# EAGLE design year-shift-r1 (EAGLE 6.5.0)
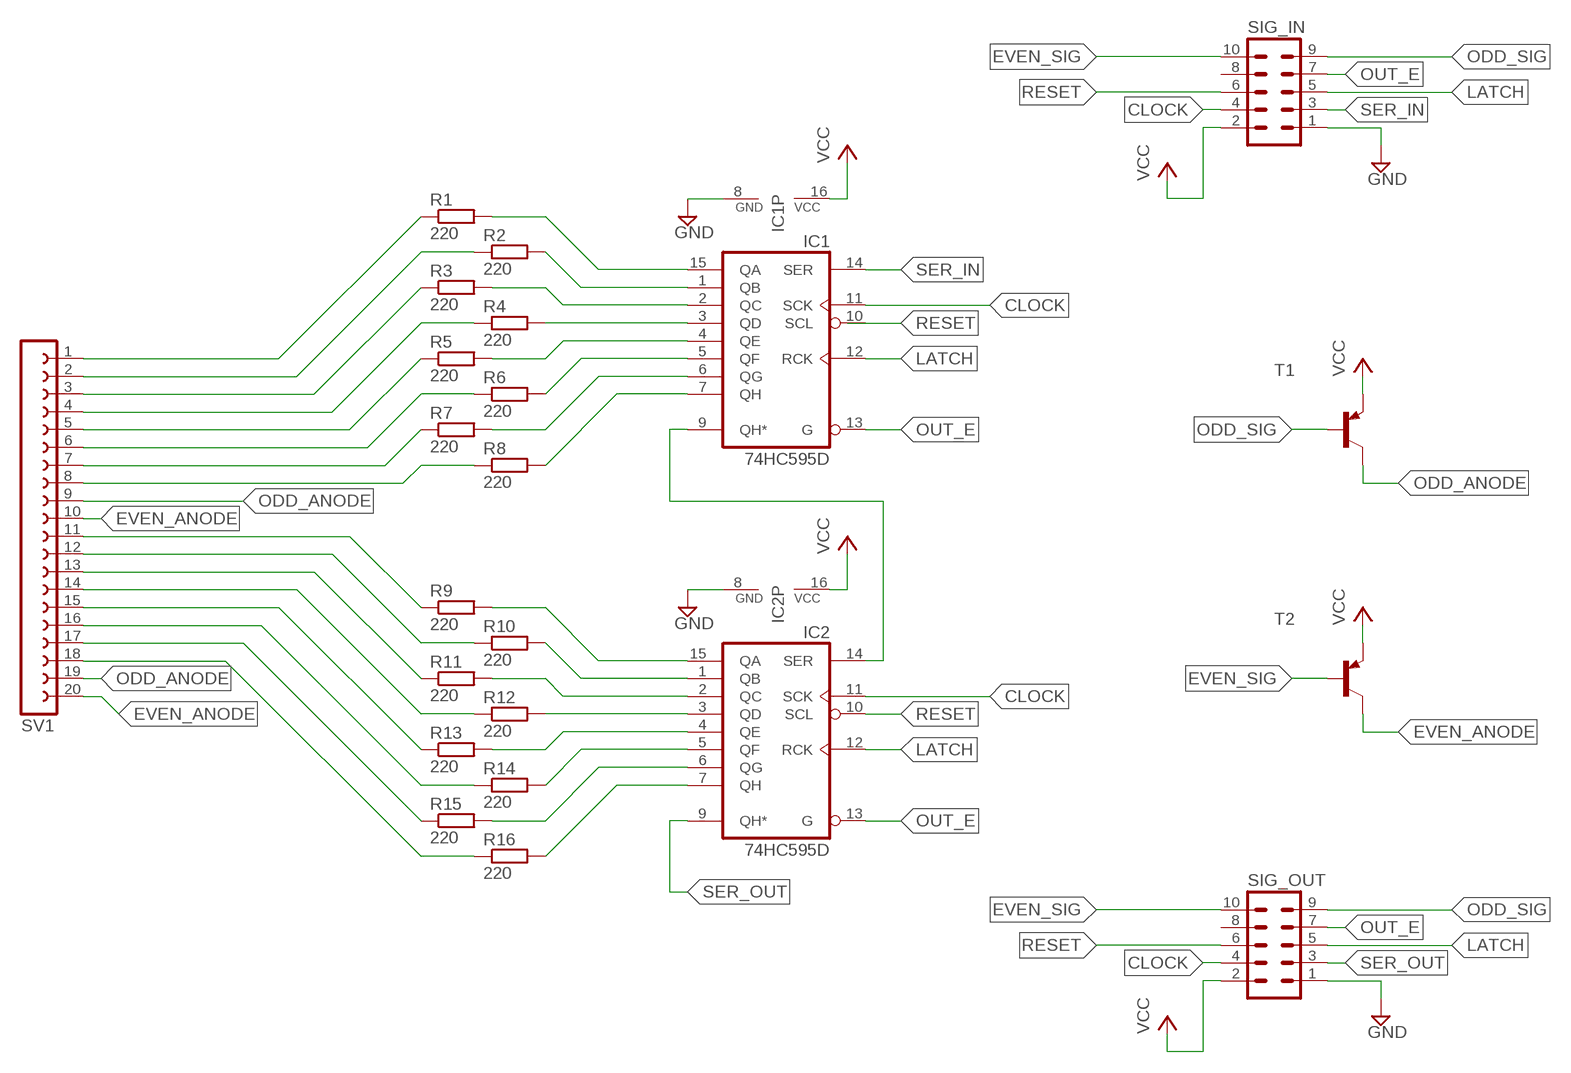
[diagram p0: schematic, sheet 1]

## Parts
IC1  74HC595D  [SO16]
IC2  74HC595D  [SO16]
R1  220  R-EU_R0805  [R0805]
R2  220  R-EU_R0805  [R0805]
R3  220  R-EU_R0805  [R0805]
R4  220  R-EU_R0805  [R0805]
R5  220  R-EU_R0805  [R0805]
R6  220  R-EU_R0805  [R0805]
R7  220  R-EU_R0805  [R0805]
R8  220  R-EU_R0805  [R0805]
R9  220  R-EU_R0805  [R0805]
R10  220  R-EU_R0805  [R0805]
R11  220  R-EU_R0805  [R0805]
R12  220  R-EU_R0805  [R0805]
R13  220  R-EU_R0805  [R0805]
R14  220  R-EU_R0805  [R0805]
R15  220  R-EU_R0805  [R0805]
R16  220  R-EU_R0805  [R0805]
SIG_IN  MA05-2  [MA05-2]
SIG_OUT  MA05-2  [MA05-2]
SV1  FE20-1  [FE20]
T1  BC557B-PNP-TO92-EBC  [TO92-EBC]
T2  BC557B-PNP-TO92-EBC  [TO92-EBC]

## Nets
CLOCK: IC1.11(SCK) IC2.11(SCK) SIG_IN.4 SIG_OUT.4
EVEN_ANODE: SV1.10 SV1.20 T2.C
EVEN_SIG: SIG_IN.10 SIG_OUT.10 T2.B
GND: IC1.8(GND) IC2.8(GND) SIG_IN.1 SIG_OUT.1
LATCH: IC1.12(RCK) IC2.12(RCK) SIG_IN.5 SIG_OUT.5
N$1: IC1.15(QA) R1.2
N$2: IC1.2(QC) R3.2
N$3: IC1.4(QE) R5.2
N$4: IC1.6(QG) R7.2
N$5: R8.1 SV1.8
N$6: R6.1 SV1.6
N$7: R4.1 SV1.4
N$8: R2.1 SV1.2
N$9: IC1.1(QB) R2.2
N$10: IC1.3(QD) R4.2
N$11: IC1.5(QF) R6.2
N$12: IC1.7(QH) R8.2
N$13: IC2.15(QA) R9.2
N$14: IC2.2(QC) R11.2
N$15: IC2.4(QE) R13.2
N$16: IC2.6(QG) R15.2
N$17: R16.1 SV1.18
N$18: R14.1 SV1.16
N$19: R12.1 SV1.14
N$20: R10.1 SV1.12
N$21: IC2.1(QB) R10.2
N$22: IC2.3(QD) R12.2
N$23: IC2.5(QF) R14.2
N$24: IC2.7(QH) R16.2
N$25: IC1.9(QH*) IC2.14(SER)
N$26: R1.1 SV1.1
N$27: R3.1 SV1.3
N$28: R5.1 SV1.5
N$29: R7.1 SV1.7
N$30: R9.1 SV1.11
N$31: R11.1 SV1.13
N$32: R13.1 SV1.15
N$33: R15.1 SV1.17
ODD_ANODE: SV1.9 SV1.19 T1.C
ODD_SIG: SIG_IN.9 SIG_OUT.9 T1.B
OUT_E: IC1.13(G) IC2.13(G) SIG_IN.7 SIG_OUT.7
RESET: IC2.10(SCL) SIG_IN.6 SIG_OUT.6
SER_IN: IC1.14(SER) SIG_IN.3
SER_OUT: IC2.9(QH*) SIG_OUT.3
VCC: IC1.16(VCC) IC2.16(VCC) SIG_IN.2 SIG_OUT.2 T1.E T2.E
Unconnected: IC1.10(SCL) SIG_IN.8 SIG_OUT.8

## Library data of the parts
IC1 IC2 = 74xx-eu:74*595: 8-bit SHIFT REGISTER, output latch
R1-R16 = rcl:R-EU_: RESISTOR, European symbol
SIG_IN SIG_OUT = con-lstb:MA05-2: PIN HEADER; OC_FARNELL: unknown; OC_NEWARK: unknown
SV1 = con-lsta:FE20-1: FEMALE HEADER; OC_FARNELL: unknown; OC_NEWARK: unknown
T1 T2 = transistor:*-PNP-: PNP Transistror

## Board
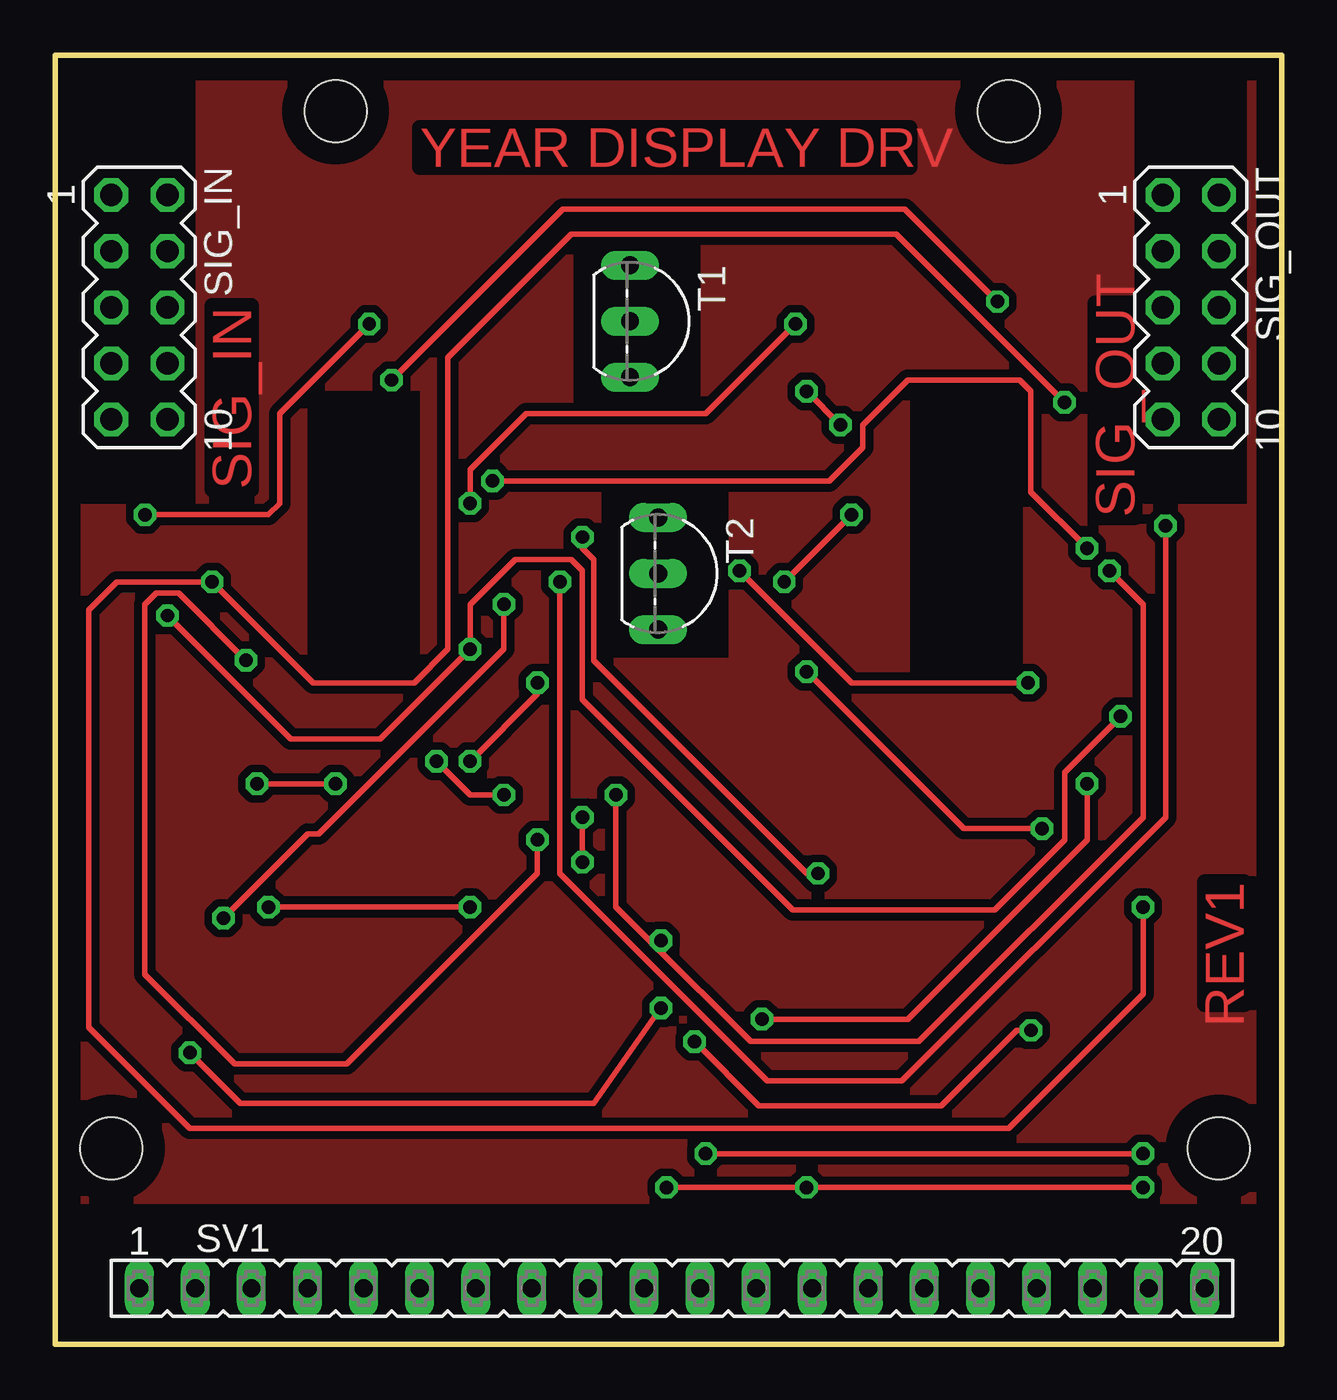
[diagram p1: board, top side]
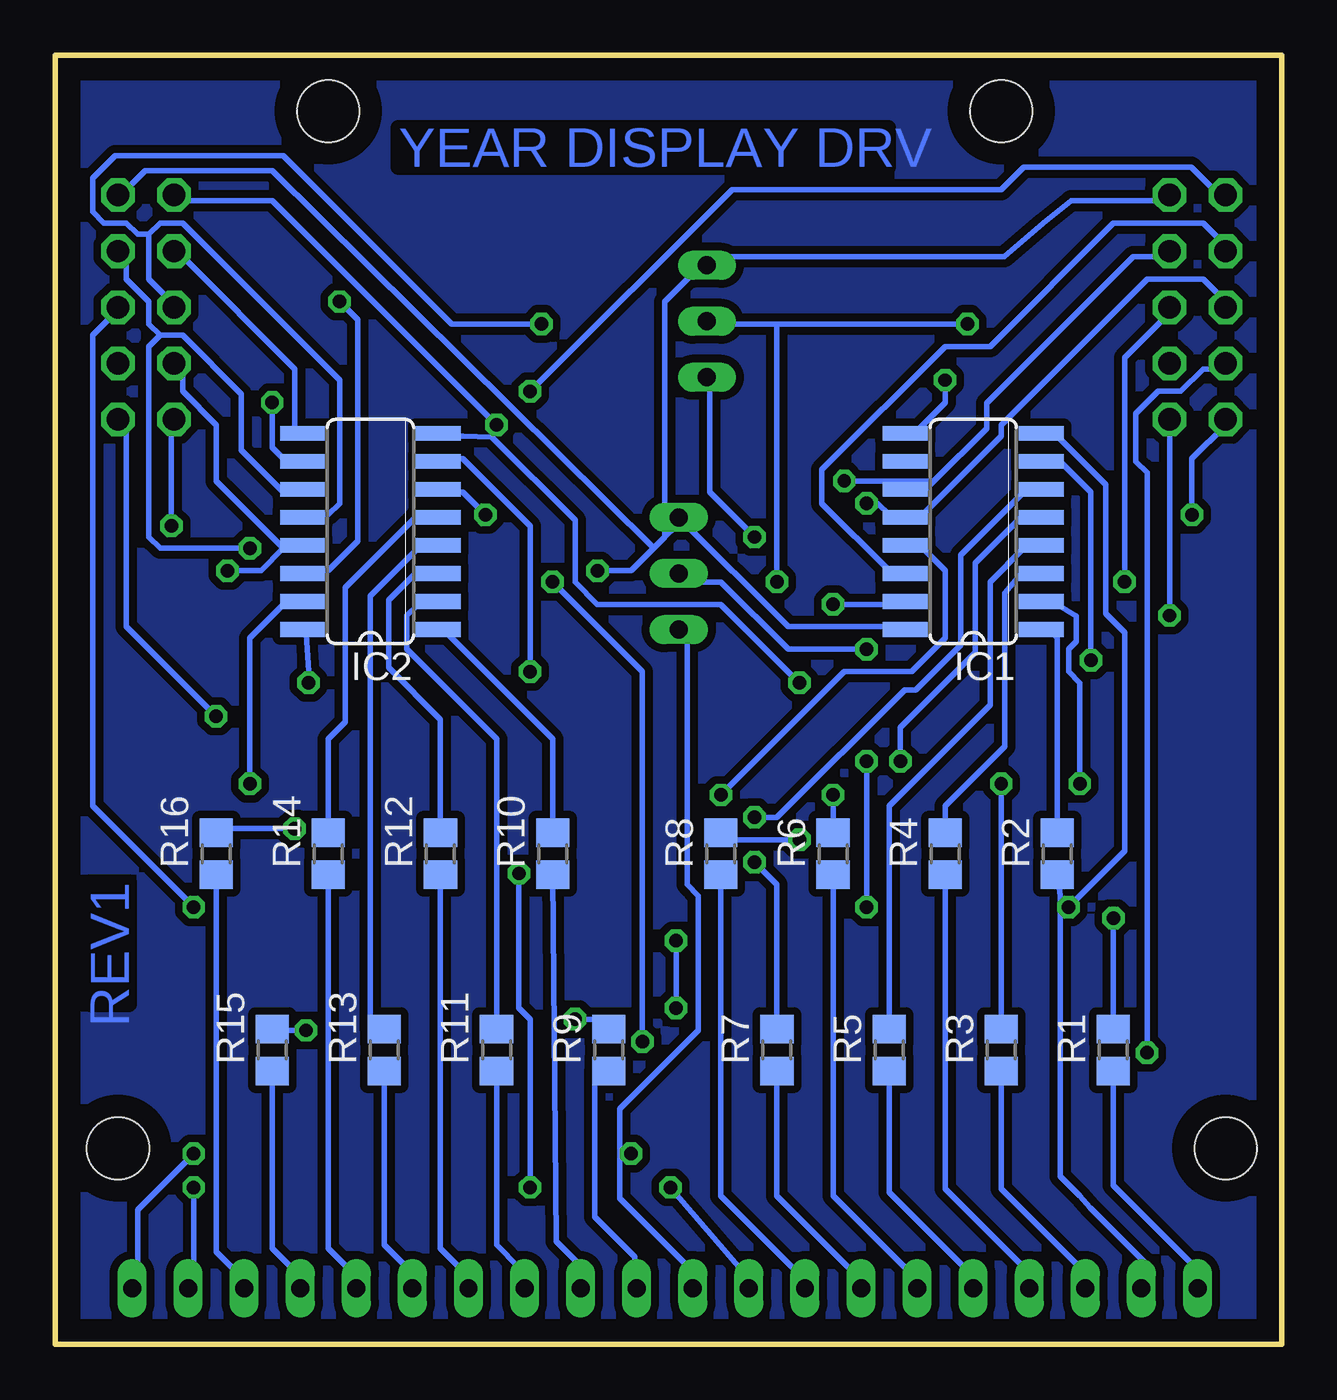
[diagram p2: board, bottom side, seen from below]

Size 55.55 x 58.41 mm. Coordinates in mm from the lower left corner, seen from the top.
Outline: 0,0 55.55,0 55.55,58.41 0,58.41 0,0
Copper layers (1*16): Top 0.035mm / dielectric 1.5mm / Bottom 0.035mm
Design rules "default *": minimum track width 10mil, minimum drill 24mil, track to track 14mil, track to pad 14mil, pad to pad 14mil, via to via 14mil, smd to smd 14mil, copper to edge 40mil, drill to drill 8mil, minimum pad ring 10mil, minimum via ring 8mil, stop-mask expansion 4mil, vias tented up to drill 0mil, thermal gap 10mil
Holes 2.8 mm at 12.7,55.88 43.18,55.88 2.54,8.89 52.7,8.89
tRestrict: area 1.3,1.3 to 54.6,6.3; area 1.3,38.1 to 6.3,58.4; area 48.9,38.1 to 54,58.4; area 11.4,30.5 to 16.5,43.2; area 38.7,30.5 to 43.8,43.2; area 23.5,42.5 to 29.2,50.2; area 24.8,31.1 to 30.5,38.7

### Footprints (pad centres in the part's own frame; a part is rotated, then mirrored left to right if it is on the bottom)
SO16 = smd 0.66 x 2.032: 1 -4.445,-3.073; 2 -3.175,-3.073; 3 -1.905,-3.073; 4 -0.635,-3.073; 5 0.635,-3.073; 6 1.905,-3.073; 7 3.175,-3.073; 8 4.445,-3.073; 9 4.445,3.073; 10 3.175,3.073; 11 1.905,3.073; 12 0.635,3.073; 13 -0.635,3.073; 14 -1.905,3.073; 15 -3.175,3.073; 16 -4.445,3.073
R0805 = smd 1.3 x 1.5: 1 -0.95,0; 2 0.95,0
MA05-2 = drill 1.016 octagon: 1 -5.08,-1.27; 2 -5.08,1.27; 3 -2.54,-1.27; 4 -2.54,1.27; 5 0,-1.27; 6 0,1.27; 7 2.54,-1.27; 8 2.54,1.27; 9 5.08,-1.27; 10 5.08,1.27
FE20 = drill 0.813 long: 1 -24.13,0; 2 -21.59,0; 3 -19.05,0; 4 -16.51,0; 5 -13.97,0; 6 -11.43,0; 7 -8.89,0; 8 -6.35,0; 9 -3.81,0; 10 -1.27,0; 11 1.27,0; 12 3.81,0; 13 6.35,0; 14 8.89,0; 15 11.43,0; 16 13.97,0; 17 16.51,0; 18 19.05,0; 19 21.59,0; 20 24.13,0
TO92-EBC = drill 0.813 long: B 0,-1.27; C 2.54,-1.27; E -2.54,-1.27

### Placement (x,y rotation side)
IC1  13.97,36.83 90 bottom
IC2  41.27,36.83 90 bottom
R1  7.62,13.34 90 bottom
R2  10.16,22.23 90 bottom
R3  12.7,13.34 90 bottom
R4  15.24,22.23 90 bottom
R5  17.78,13.34 90 bottom
R6  20.32,22.23 90 bottom
R7  22.86,13.34 90 bottom
R8  25.4,22.23 90 bottom
R9  30.48,13.34 90 bottom
R10  33.02,22.23 90 bottom
R11  35.56,13.34 90 bottom
R12  38.1,22.23 90 bottom
R13  40.64,13.34 90 bottom
R14  43.18,22.23 90 bottom
R15  45.72,13.34 90 bottom
R16  48.26,22.23 90 bottom
SIG_IN  3.81,46.99 270 top
SIG_OUT  51.44,46.99 270 top
SV1  27.94,2.54 0 top
T1  27.3,46.35 270 top
T2  28.57,34.92 270 top

### Tracks (layer width: path | path; a pad name or v marks a point on that pad's centre or on a via)
CLOCK  (via drill 0.61)
  Top 0.254: v46.74,36.07 44.2,38.61 44.2,43.18 43.69,43.69 38.61,43.69 36.58,41.66 36.58,40.64 35.05,39.12 v19.81,39.12
  Bottom 0.254: 50.8,45.72 49.78,45.72 47.12,43.05 47.12,40.51 45.21,38.61 44.7,38.61 IC2.11 | 50.8,45.72 51.31,46.23 51.31,47.24 52.32,48.26 52.32,49.28 SIG_OUT.4 | 15.75,39.12 13.37,41.5 13.37,42.64 6.73,49.28 5.08,49.28 SIG_IN.4 | 15.75,39.12 16.26,38.61 16.76,38.61 IC1.11 | 50.8,45.72 51.31,45.21 51.31,36.58 50.8,36.07 v46.74,36.07 | 15.75,39.12 v19.81,39.12
EVEN_ANODE  (via drill 0.61)
  Top 0.254: v29.46,8.64 v49.28,8.64
  Bottom 0.254: 29.97,8.64 29.97,10.67 26.42,14.22 26.42,20.32 26.92,20.83 26.92,32 T2.C | 29.97,8.64 29.97,6.6 26.92,3.56 26.92,2.54 SV1.10 | v49.28,8.64 51.82,6.1 51.82,2.54 SV1.20 | 29.97,8.64 v29.46,8.64
EVEN_SIG  (via drill 0.61)
  Top 0.254: v5.08,33.02 10.67,27.43 14.73,27.43 v18.8,31.5 18.8,33.53 20.83,35.56 23.37,35.56 23.88,35.05 23.88,29.21 33.4,19.68 42.55,19.68 45.72,22.86 45.72,25.91 v48.26,28.45
  Bottom 0.254: v18.8,31.5 22.35,31.5 25.4,34.54 26.92,34.54 T2.B | SIG_IN.10 v5.08,33.02 | v48.26,28.45 52.32,32.51 52.32,41.66 SIG_OUT.10
GND  (via drill 0.61)
  Top 0.254: v18.8,19.81 v9.65,19.81 | v18.8,26.42 21.84,29.46 v21.84,29.97 | v35.56,41.66 v34.04,43.18
  Bottom 0.254: 11.18,41.15 IC1.8 10.67,41.15 10.16,41.15 7.97,38.96 7.97,33.12 7.11,32.26 7.11,22.35 v9.65,19.81 | v18.8,26.42 v18.8,19.81 | v21.84,29.97 25.4,33.53 30.99,33.53 32,34.54 32,37.34 35.78,41.12 | 35.78,41.12 37.08,41.15 38.1,41.15 IC2.8 38.61,41.15 | v34.04,43.18 24.89,52.32 12.7,52.32 11.68,53.34 4.1,53.34 3.08,52.32 2.54,52.32 SIG_IN.1 | 35.78,41.12 v35.56,41.66 45.72,51.82 49.78,51.82 SIG_OUT.1
LATCH  (via drill 0.61)
  Top 0.254: v33.53,46.23 29.46,42.16 21.34,42.16 18.8,39.62 v18.8,38.1
  Bottom 0.254: 51.31,50.29 50.8,50.8 49.78,50.8 42.67,43.69 42.67,38.1 43.18,37.59 44.2,37.59 IC2.12 | 51.31,50.29 51.31,48.26 50.29,47.24 SIG_OUT.5 | SIG_IN.5 2.54,47.24 3.56,48.26 6.1,48.26 12.7,41.66 12.7,41.15 16.26,37.59 16.76,37.59 IC1.12 17.27,37.59 17.78,37.59 18.29,38.1 v18.8,38.1 | 51.31,50.29 51.82,50.29 52.32,50.8 53.34,50.8 53.85,51.31 53.85,52.83 52.83,53.85 45.21,53.85 37.59,46.23 v33.53,46.23
N$1  (via drill 0.61)
  Top 0.254: v7.62,19.3 11.43,23.11 11.94,23.11 20.32,31.5 v20.32,33.53
  Bottom 0.254: v7.62,19.3 R1.2 | v20.32,33.53 17.27,33.53 IC1.15
N$2  (via drill 0.61)
  Top 0.254: v9.14,25.4 v12.7,25.4
  Bottom 0.254: v12.7,25.4 R3.2 | v9.14,25.4 9.14,29.97 9.65,30.48 9.65,31.5 9.3,31.84 9.3,32.99 10.16,33.53 10.67,33.53 IC1.2
N$3
  Bottom 0.254: R5.2 17.78,24.38 13.21,28.96 13.21,34.54 11.68,36.07 11.18,36.07 IC1.4
N$4  (via drill 0.61)
  Top 0.254: v23.88,23.88 v23.88,21.84
  Bottom 0.254: R7.2 22.86,20.83 v23.88,21.84 | v23.88,23.88 22.86,23.88 17.08,29.65 16.57,29.65 14.54,31.69 14.54,35.75 11.68,38.61 11.18,38.61 IC1.6
N$5
  Bottom 0.254: R8.1 25.4,6.73 21.84,3.17 SV1.8
N$6
  Bottom 0.254: R6.1 20.32,6.73 16.76,3.17 SV1.6
N$7
  Bottom 0.254: R4.1 15.24,7.05 11.68,3.49 SV1.4
N$8
  Bottom 0.254: R2.1 10.16,21.46 10.03,20.32 10.03,7.62 9.14,6.73 8.67,6.19 6.13,3.65 SV1.2
N$9
  Bottom 0.254: R2.2 10.16,32 10.67,32.51 IC1.1
N$10
  Bottom 0.254: R4.2 15.24,24.38 12.54,27.08 12.54,34.04 11.68,35.05 11.18,35.05 IC1.3
N$11  (via drill 0.61)
  Top 0.254: v20.32,24.89 18.8,24.89 v17.27,26.42
  Bottom 0.254: v20.32,24.89 R6.2 | v17.27,26.42 17.27,27.94 13.88,31.34 13.88,35.4 11.68,37.59 11.18,37.59 IC1.5
N$12  (via drill 0.61)
  Top 0.254: v21.84,22.86 21.84,21.34 13.21,12.7 8.13,12.7 4.06,16.76 4.06,33.53 4.57,34.04 5.59,34.04 v8.64,30.99
  Bottom 0.254: v21.84,22.86 25.4,22.86 R8.2 | v8.64,30.99 8.64,38.61 10.16,40.13 10.67,40.13 IC1.7
N$13  (via drill 0.61)
  Top 0.254: v32,14.73 38.61,14.73 46.74,22.86 v46.74,25.4
  Bottom 0.254: v32,14.73 30.48,14.73 R9.2 | v46.74,25.4 46.74,32 45.21,33.53 44.7,33.53 IC2.15
N$14
  Bottom 0.254: R11.2 35.56,27.43 39.62,31.5 39.62,33.02 39.12,33.53 38.61,33.53 IC2.2
N$15
  Bottom 0.254: R13.2 41.27,14.29 41.27,33.91 39.12,36.07 38.61,36.07 IC2.4
N$16  (via drill 0.61)
  Top 0.254: v44.2,14.22 43.56,14.22 40.13,10.79 31.88,10.79 v28.96,13.72 | v36.07,37.59 v33.02,34.54
  Bottom 0.254: v44.2,14.22 45.72,14.22 R15.2 | v28.96,13.72 28.96,30.48 v33.02,34.54 | v36.07,37.59 37.08,38.61 38.1,38.61 IC2.6
N$17
  Bottom 0.254: R16.1 48.26,4.19 47.24,3.17 SV1.18
N$18
  Bottom 0.254: R14.1 43.18,4.35 42.16,3.33 SV1.16
N$19
  Bottom 0.254: R12.1 38.1,4.35 37.08,3.33 SV1.14
N$20
  Bottom 0.254: R10.1 32.86,4.67 31.84,3.65 SV1.12
N$21
  Bottom 0.254: R10.2 33.02,27.43 38.1,32.51 IC2.1
N$22
  Bottom 0.254: R12.2 38.1,28.32 40.45,30.67 40.45,33.72 39.12,35.05 38.61,35.05 IC2.3
N$23
  Bottom 0.254: R14.2 43.18,27.43 42.42,28.19 42.42,34.29 39.12,37.59 38.61,37.59 IC2.5
N$24  (via drill 0.61)
  Top 0.254: v44.7,23.37 41.15,23.37 v34.04,30.48
  Bottom 0.254: v44.7,23.37 48.26,23.37 R16.2 | v34.04,30.48 34.04,37.08 37.08,40.13 38.1,40.13 IC2.7
N$25  (via drill 0.61)
  Top 0.254: v42.67,47.24 38.48,51.44 22.99,51.44 v15.24,43.69
  Bottom 0.254: v42.67,47.24 41.85,46.42 41.85,36.39 43.18,35.05 44.2,35.05 IC2.14 | v15.24,43.69 15.24,42.67 16.76,41.15 IC1.9
N$26
  Bottom 0.254: R1.1 7.62,7.21 4.06,3.65 SV1.1
N$27
  Bottom 0.254: R3.1 12.7,7.05 9.14,3.49 SV1.3
N$28
  Bottom 0.254: R5.1 17.78,6.89 14.22,3.33 SV1.5
N$29
  Bottom 0.254: R7.1 22.86,6.73 19.3,3.17 SV1.7
N$30
  Bottom 0.254: R9.1 31.11,12.38 31.11,5.78 29.3,3.97 SV1.11
N$31
  Bottom 0.254: R11.1 35.56,4.51 34.54,3.49 SV1.13
N$32
  Bottom 0.254: R13.1 40.64,4.51 39.62,3.49 SV1.15
N$33
  Bottom 0.254: R15.1 45.72,4.35 44.7,3.33 SV1.17
N$34
  pour Bottom: 0,58.42 55.24,58.42 55.24,-0.64 0,-0.64
N$35
  pour Top: 0,58.42 55.24,58.42 55.24,0 0,0
ODD_ANODE  (via drill 0.61)
  Top 0.254: v49.28,7.11 v34.04,7.11 v27.69,7.11 | v23.88,36.58 23.88,36.07 24.38,35.56 24.38,30.99 34.04,21.34 v34.54,21.34
  Bottom 0.254: v27.69,7.11 23.75,2.54 SV1.9 | v49.28,7.11 49.28,2.54 SV1.19 | v23.88,36.58 25.91,38.61 25.91,43.69 T1.C | v34.54,21.34 34.54,15.24 34.04,14.73 v34.04,7.11
ODD_SIG  (via drill 0.61)
  Top 0.254: v14.22,46.23 10.16,42.16 10.16,38.1 9.65,37.59 v4.06,37.59 | v50.29,37.08 50.29,23.88 38.35,11.94 32.26,11.94 22.86,21.34 v22.86,34.54
  Bottom 0.254: v14.22,46.23 22.86,46.23 | 22.86,46.23 25.91,46.23 T1.B | v4.06,37.59 4.06,40.13 2.54,41.66 SIG_IN.9 | v50.29,37.08 50.29,41.66 SIG_OUT.9 | 22.86,46.23 v22.86,34.54
OUT_E  (via drill 0.61)
  Top 0.254: v25.4,24.89 25.4,19.81 26.92,18.29 | 26.92,18.29 31.5,13.72 39.12,13.72 49.28,23.88 49.28,33.53 v47.75,35.05 | v6.1,13.21 8.38,10.92 24.38,10.92 v27.43,15.24 | 26.92,18.29 v27.43,18.29
  Bottom 0.254: v25.4,24.89 19.81,30.48 16.76,30.48 15.24,32 15.24,35.05 16.26,36.07 16.76,36.07 IC1.13 | v47.75,35.05 46.23,35.05 45.21,36.07 | 45.21,36.07 44.7,36.07 IC2.13 45.21,36.07 | v6.1,13.21 6.1,39.5 6.6,40.01 6.6,42.16 5.59,43.18 4.57,43.18 3.56,44.2 2.54,44.2 SIG_IN.7 | v27.43,18.29 v27.43,15.24 | 45.21,36.07 48.26,39.12 48.26,41.66 49.78,43.18 49.78,44.2 SIG_OUT.7
RESET  (via drill 0.61)
  Top 0.254: v45.72,42.67 38.1,50.29 23.37,50.29 17.78,44.7 17.78,31.5 16.26,29.97 11.68,29.97 v7.11,34.54 2.79,34.54 1.52,33.27 1.52,14.35 6.1,9.78 43.18,9.78 49.28,15.88 v49.28,19.81
  Bottom 0.254: v45.72,42.67 45.72,40.64 45.21,40.13 44.7,40.13 IC2.10 | v7.11,34.54 7.11,44.7 5.08,46.74 SIG_IN.6 | v49.28,19.81 53.85,24.38 53.85,45.72 52.83,46.74 SIG_OUT.6
SER_IN
  Bottom 0.254: IC1.14 17.27,35.05 17.78,35.05 20.83,38.1 20.83,39.62 15.24,45.21 13.21,45.21 7.62,50.8 3.56,50.8 2.54,49.78 SIG_IN.3
SER_OUT
  Bottom 0.254: IC2.9 44.7,41.15 44.7,44.2 49.78,49.28 SIG_OUT.3
VCC  (via drill 0.61)
  Top 0.254: v44.07,29.97 36.07,29.97 v30.99,35.05
  Bottom 0.254: 44.7,32.51 IC2.16 44.2,32.51 44.07,30.48 v44.07,29.97 | IC1.16 17.27,32.51 22.35,32.51 T2.E 27.43,37.08 27.94,36.58 | v30.99,35.05 29.46,35.05 28.45,36.07 | 27.94,36.58 28.45,36.07 | 27.94,36.58 27.94,47.24 26.42,48.77 T1.E 25.91,49.28 12.57,49.28 10.79,50.8 9.53,51.82 5.08,51.82 SIG_IN.2 | 28.45,36.07 45.72,53.18 51.47,53.18 52.32,52.32 SIG_OUT.2

### Text on the board
Top: YEAR DISPLAY DRV | SIG_IN | SIG_OUT | REV1
Bottom: YEAR DISPLAY DRV | REV1